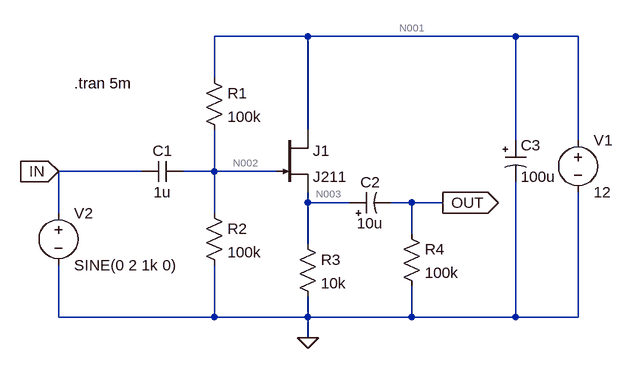
[diagram p0: schematic Circuit7_15.asc]
Circuit7_15.asc, the LTspice schematic file:
Version 4
SHEET 1 880 680
WIRE 160 96 16 96
WIRE 480 96 160 96
WIRE 576 96 480 96
WIRE 16 160 16 96
WIRE 160 240 160 96
WIRE 480 256 480 96
WIRE 576 256 576 96
WIRE -96 304 -224 304
WIRE 16 304 16 240
WIRE 16 304 -32 304
WIRE 112 304 16 304
WIRE 160 352 160 336
WIRE 224 352 160 352
WIRE 320 352 288 352
WIRE 368 352 320 352
WIRE -224 368 -224 304
WIRE 16 368 16 304
WIRE 320 400 320 352
WIRE 160 416 160 352
WIRE -224 528 -224 448
WIRE 16 528 16 448
WIRE 16 528 -224 528
WIRE 160 528 160 496
WIRE 160 528 16 528
WIRE 320 528 320 480
WIRE 320 528 160 528
WIRE 480 528 480 320
WIRE 480 528 320 528
WIRE 576 528 576 336
WIRE 576 528 480 528
WIRE 160 560 160 528
FLAG 160 560 0
FLAG -224 304 IN
IOPIN -224 304 In
FLAG 368 352 OUT
IOPIN 368 352 Out
SYMBOL voltage 576 240 R0
SYMATTR InstName V1
SYMATTR Value 12
SYMBOL njf 112 240 R0
SYMATTR InstName J1
SYMATTR Value J211
SYMBOL cap -32 288 R90
WINDOW 0 0 32 VBottom 2
WINDOW 3 32 32 VTop 2
SYMATTR InstName C1
SYMATTR Value 1u
SYMBOL res 0 144 R0
SYMATTR InstName R1
SYMATTR Value 100k
SYMBOL res 0 352 R0
SYMATTR InstName R2
SYMATTR Value 100k
SYMBOL res 144 400 R0
SYMATTR InstName R3
SYMATTR Value 10k
SYMBOL voltage -224 352 R0
SYMATTR InstName V2
SYMATTR Value SINE(0 2 1k 0)
SYMBOL polcap 224 368 R270
WINDOW 0 32 32 VTop 2
WINDOW 3 0 32 VBottom 2
SYMATTR InstName C2
SYMATTR Value 10u
SYMBOL res 304 384 R0
SYMATTR InstName R4
SYMATTR Value 100k
SYMBOL polcap 464 256 R0
SYMATTR InstName C3
SYMATTR Value 100u
TEXT -200 168 Left 2 !.tran 5m

The netlist it stands for:
* Circuit7_15.asc
V1 N001 0 12
J1 N001 N002 N003 J211
C1 N002 IN 1u
R1 N001 N002 100k
R2 N002 0 100k
R3 N003 0 10k
V2 IN 0 SINE(0 2 1k 0)
C2 N003 OUT 10u
R4 OUT 0 100k
C3 N001 0 100u
.model NJF NJF
.model PJF PJF
.lib standard.jft
.tran 5m
.backanno
.end

* Results of the author's LTspice run, read from the files saved beside the schematic
* Operating Point, zero values left out:
*   V(n001) = 12 V
*   V(n002) = 6 V
*   V(n003) = 8.237 V
*   Id(J1) = 823.7 µA
*   Ig(J1) = -11.82 pA
*   Is(J1) = -823.7 µA
*   I(R3) = 823.7 µA
*   I(R2) = 60 µA
*   I(R1) = 60 µA
*   I(V1) = -883.7 µA
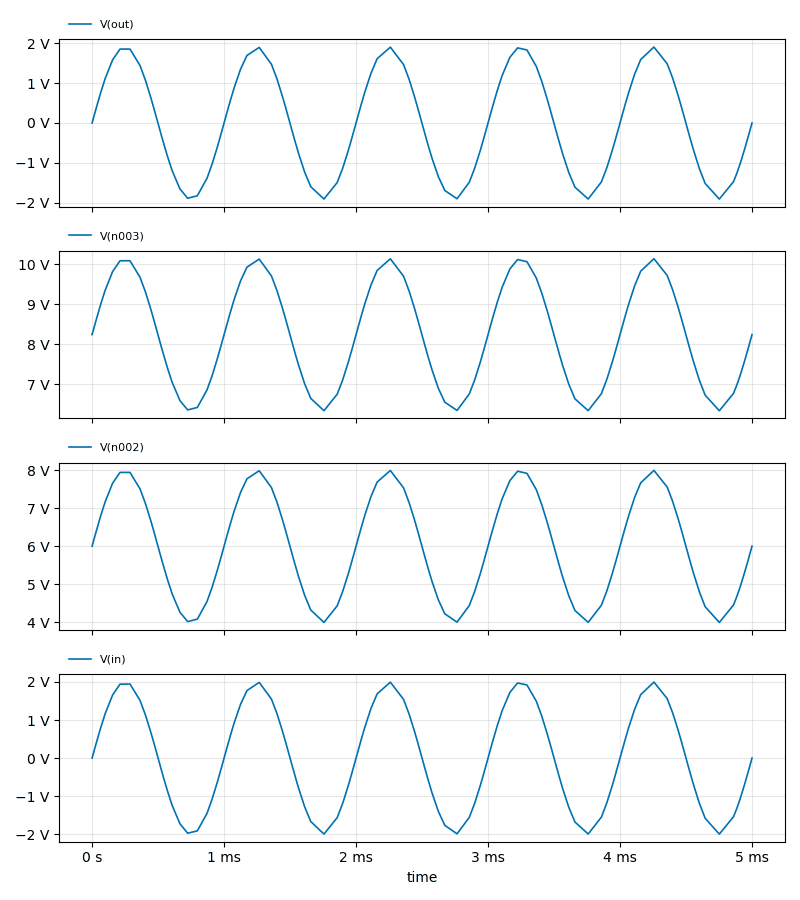
[diagram p1: Transient Analysis of Circuit7_15.asc, plotted from the saved traces]
* Transient Analysis, 1 run:
*   V(out): min -1.907 V, max 1.903 V, average -2.287 mV, rms 1.328 V, last 598.1 µV
*   V(n003): min 6.33 V, max 10.14 V, average 8.235 V, rms 8.341 V, last 8.237 V
*   V(n002): min 3.997 V, max 7.99 V, average 5.996 V, rms 6.155 V, last 6.001 V
*   V(in): min -1.997 V, max 1.996 V, average 1.743 mV, rms 1.392 V, last 0 V